# Altium schematic sheet DRV5021A3QDBZR.SchDoc
size A; SheetNumber: 15; SheetTotal: 20
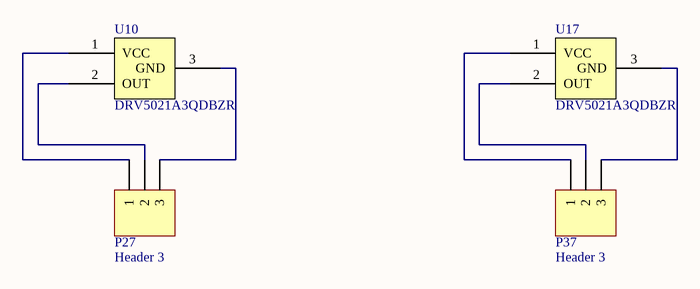
[diagram p0: DRV5021A3QDBZR.SchDoc]

## Parts
P27  Header 3  [HDR1X3]
P37  Header 3  [HDR1X3]
U10  DRV5021A3QDBZR  [DRV5021A3QDBZR]
U17  DRV5021A3QDBZR  [DRV5021A3QDBZR]

## Nets
NetP27_1: P27.1 U10.1(VCC)
NetP27_2: P27.2 U10.2(OUT)
NetP27_3: P27.3 U10.3(GND)
NetP37_1: P37.1 U17.1(VCC)
NetP37_2: P37.2 U17.2(OUT)
NetP37_3: P37.3 U17.3(GND)

## Library data of the parts
P27 P37 = Header 3: Header, 3-Pin; LatestRevisionDate: 17-Jul-2002; LatestRevisionNote: Re-released for DXP Platform.; Publisher: Altium Limited
U10 U17 = DRV5021A3QDBZR: Hall effect IC